# Altium schematic sheet SD Card.SchDoc
size A; SheetNumber: 3; SheetTotal: 14
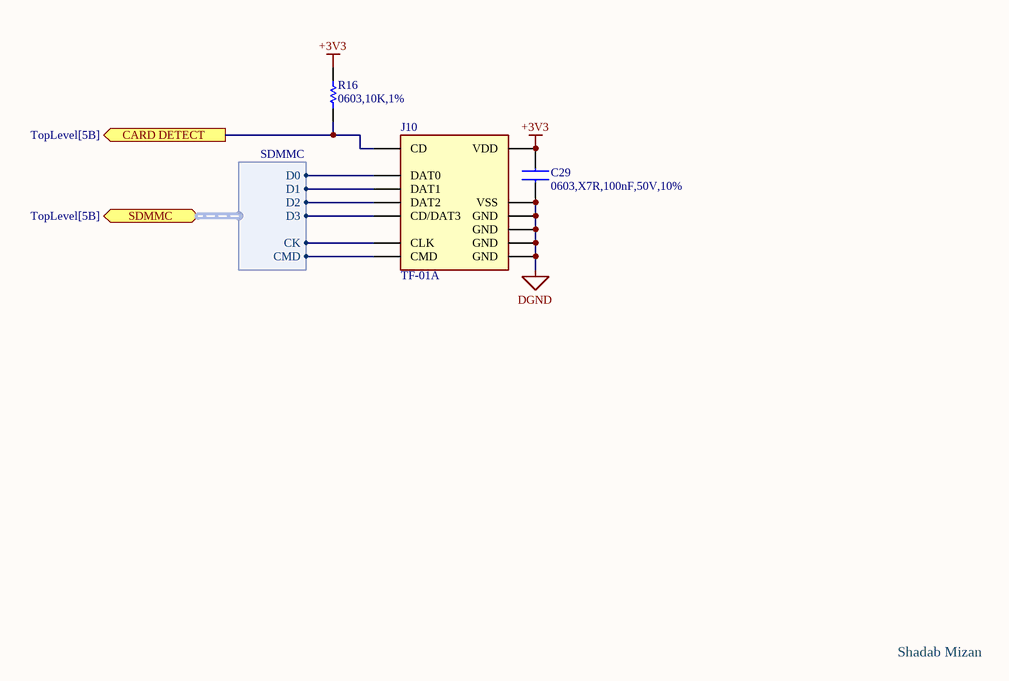
[diagram p0: SD Card.SchDoc]

## Parts
C29  0603,X7R,100nF,50V,10%  [CAPC1608X90N]
J10  TF-01A  [TF-SMD_TF-01A]
R16  0603,10K,1%  [RESC1608X90N]

## Ports
CARD DETECT (out, see TopLevel[5B]), SDMMC (bidir, harness SDMMC, see TopLevel[5B])

## Harnesses
SDMMC: CK, CMD, D0, D1, D2, D3

## Nets
+3V3: C29.2 J10.4(VDD) R16.2
DGND: C29.1 J10.6(VSS) J10.10(GND) J10.11(GND) J10.12(GND) J10.13(GND)
CARD DETECT: J10.9(CD) R16.1 ; port CARD DETECT
NetJ10_1: J10.1(DAT2) ; port SDMMC.D2
NetJ10_2: J10.2(CD/DAT3) ; port SDMMC.D3
NetJ10_3: J10.3(CMD) ; port SDMMC.CMD
NetJ10_5: J10.5(CLK) ; port SDMMC.CK
NetJ10_7: J10.7(DAT0) ; port SDMMC.D0
NetJ10_8: J10.8(DAT1) ; port SDMMC.D1

## Notes on the sheet
- Shadab Mizan

## Library data of the parts
C29 = CC0603KRX7R9BB104: 50V 100nF X7R ±10% 0603 Multilayer Ceramic Capacitors MLCC - SMD/SMT ROHS; LCSC Part #: C14663; Manu Part #: CC0603KRX7R9BB104
J10 = TF-01A: Micro SD card (TF card) Connector and Ejector Push-Push Surface Mount; Manu Part #: TF-01A; LCSC Part #: C41426929
R16 = 0603WAF1002T5E: 100mW Thick Film Resistor 75V ±100ppm/℃ ±1% 10kΩ 0603 Chip Resistor - Surface Mount ROHS; LCSC Part #: C25804; Manu Part #: 0603WAF1002T5E